# EAGLE design thinMan (EAGLE 6.6.0)

## Sheet 1 of 4
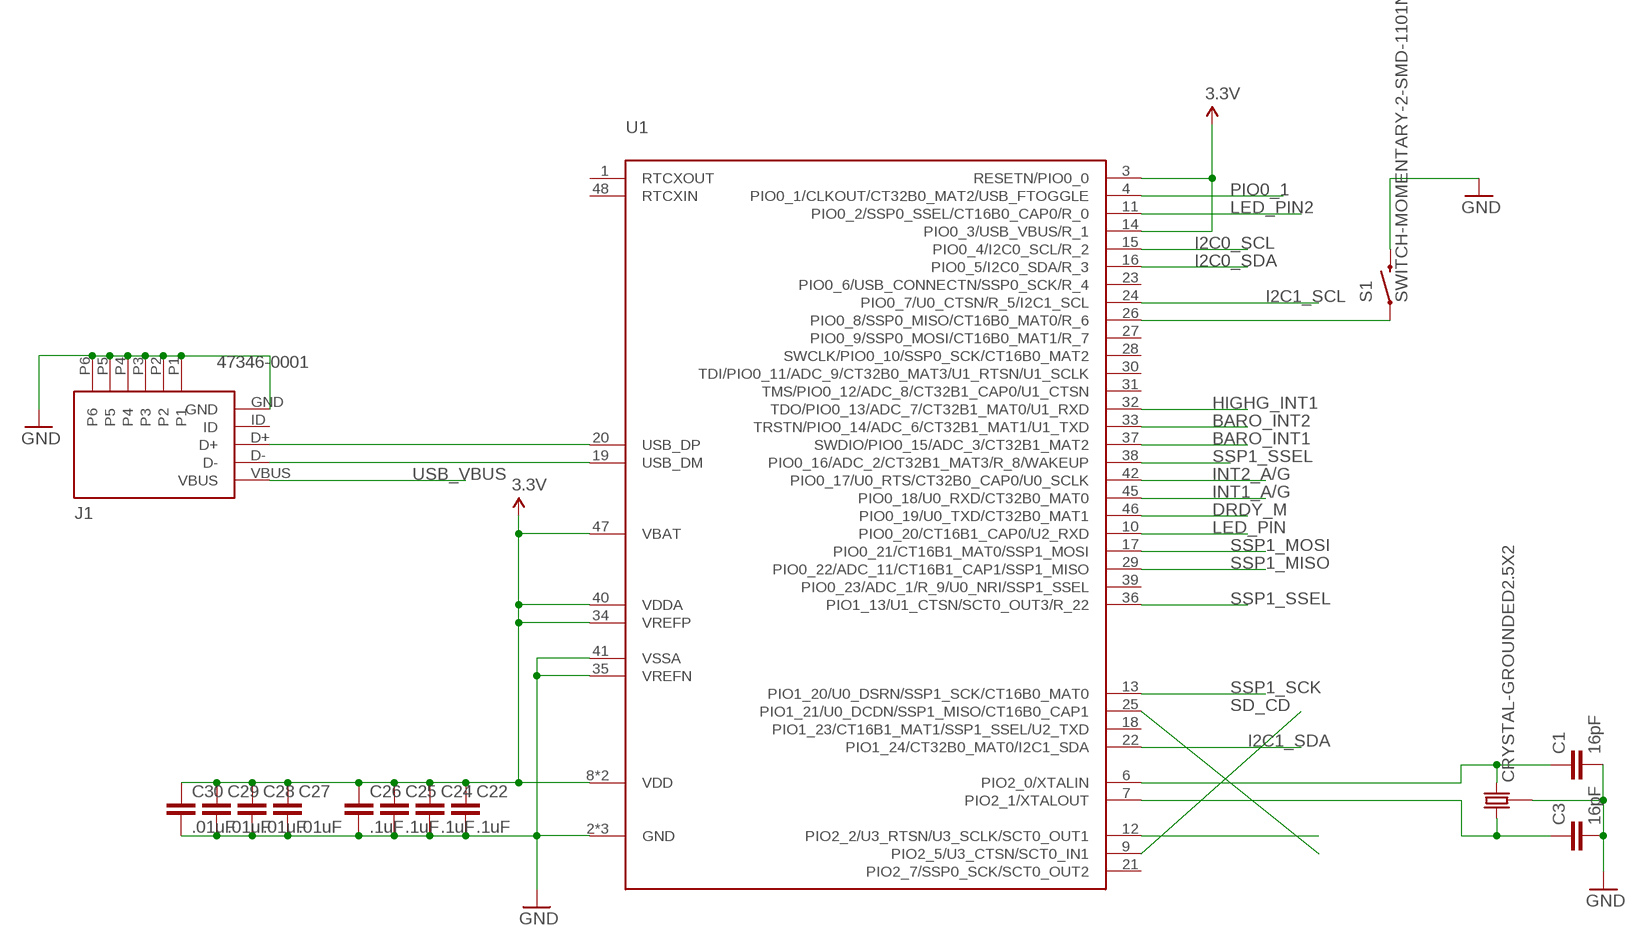
[diagram p0: schematic, sheet 1]

### Parts
C1  16pF  C0402  [C0402]
C3  16pF  C0402  [C0402]
C22  .1uF  C0402  [C0402]
C24  .1uF  C0402  [C0402]
C25  .1uF  C0402  [C0402]
C26  .1uF  C0402  [C0402]
C27  .01uF  C0402  [C0402]
C28  .01uF  C0402  [C0402]
C29  .01uF  C0402  [C0402]
C30  .01uF  C0402  [C0402]
J1  47346-0001  MICRO-USB  [MICRO_USB]
S1  SWITCH-MOMENTARY-2-SMD-1101NE  [TACTILE-SWITCH-1101NE]
U1  LPC11U68JBD48  [LQFP48]
U$5  CRYSTAL-GROUNDED2.5X2  [CRYSTAL-SMD-2.5X2]

### Nets
3.3V: C22.1 C24.1 C25.1 C26.1 C27.1 C28.1 C29.1 C30.1 U1.3(RESETN/PIO0_0) U1.8(VDD) U1.14(PIO0_3/USB_VBUS/R_1) U1.34(VREFP) U1.40(VDDA) U1.44(VDD) U1.47(VBAT) ; also sheet 2,3,4
BARO_INT1: U1.37(SWDIO/PIO0_15/ADC_3/CT32B1_MAT2) ; also sheet 2
BARO_INT2: U1.33(TRSTN/PIO0_14/ADC_6/CT32B1_MAT1/U1_TXD)
DRDY_M: U1.46(PIO0_19/U0_TXD/CT32B0_MAT1) ; also sheet 2
GND: C1.2 C3.2 C22.2 C24.2 C25.2 C26.2 C27.2 C28.2 C29.2 C30.2 J1.GND J1.P1 J1.P2 J1.P3 J1.P4 J1.P5 J1.P6 S1.2 U1.2(GND) U1.5(GND) U1.35(VREFN) U1.41(VSSA) U1.43(GND) U$5.GND1 U$5.GND2 ; also sheet 2,3,4
HIGHG_INT1: U1.32(TDO/PIO0_13/ADC_7/CT32B1_MAT0/U1_RXD)
HIGHG_INT2: U1.36(PIO1_13/U1_CTSN/SCT0_OUT3/R_22)
I2C0_SCL: U1.15(PIO0_4/I2C0_SCL/R_2) ; also sheet 2
I2C0_SDA: U1.16(PIO0_5/I2C0_SDA/R_3) ; also sheet 2
I2C1_SCL: U1.24(PIO0_7/U0_CTSN/R_5/I2C1_SCL) ; also sheet 2,3
I2C1_SDA: U1.22(PIO1_24/CT32B0_MAT0/I2C1_SDA) ; also sheet 2,3
INT1_A/G: U1.45(PIO0_18/U0_RXD/CT32B0_MAT0) ; also sheet 2
INT2_A/G: U1.42(PIO0_17/U0_RTS/CT32B0_CAP0/U0_SCLK)
LED_PIN: U1.10(PIO0_20/CT16B1_CAP0/U2_RXD) ; also sheet 3
LED_PIN2: U1.11(PIO0_2/SSP0_SSEL/CT16B0_CAP0/R_0) ; also sheet 3
N$2: C3.1 U1.7(PIO2_1/XTALOUT) U$5.P1
N$3: C1.1 U1.6(PIO2_0/XTALIN) U$5.P2
N$15: J1.D+ U1.20(USB_DP)
N$17: J1.D- U1.19(USB_DM)
N$18: U1.25(PIO1_21/U0_DCDN/SSP1_MISO/CT16B0_CAP1)
N$19: S1.1 U1.26(PIO0_8/SSP0_MISO/CT16B0_MAT0/R_6)
N$22: U1.12(PIO2_2/U3_RTSN/U3_SCLK/SCT0_OUT1)
PIO0_1: U1.4(PIO0_1/CLKOUT/CT32B0_MAT2/USB_FTOGGLE) ; also sheet 4
SD_CD: U1.9(PIO2_5/U3_CTSN/SCT0_IN1) ; also sheet 3
SSP1_MISO: U1.29(PIO0_22/ADC_11/CT16B1_CAP1/SSP1_MISO) ; also sheet 3
SSP1_MOSI: U1.17(PIO0_21/CT16B1_MAT0/SSP1_MOSI) ; also sheet 3
SSP1_SCK: U1.13(PIO1_20/U0_DSRN/SSP1_SCK/CT16B0_MAT0) ; also sheet 3
SSP1_SSEL: U1.38(PIO0_16/ADC_2/CT32B1_MAT3/R_8/WAKEUP) ; also sheet 3
USB_VBUS: J1.VBUS ; also sheet 4
Unconnected: J1.ID U1.1(RTCXOUT) U1.18(PIO1_23/CT16B1_MAT1/SSP1_SSEL/U2_TXD) U1.21(PIO2_7/SSP0_SCK/SCT0_OUT2) U1.23(PIO0_6/USB_CONNECTN/SSP0_SCK/R_4) U1.27(PIO0_9/SSP0_MOSI/CT16B0_MAT1/R_7) U1.28(SWCLK/PIO0_10/SSP0_SCK/CT16B0_MAT2) U1.30(TDI/PIO0_11/ADC_9/CT32B0_MAT3/U1_RTSN/U1_SCLK) U1.31(TMS/PIO0_12/ADC_8/CT32B1_CAP0/U1_CTSN) U1.39(PIO0_23/ADC_1/R_9/U0_NRI/SSP1_SSEL) U1.48(RTCXIN)

## Sheet 2 of 4
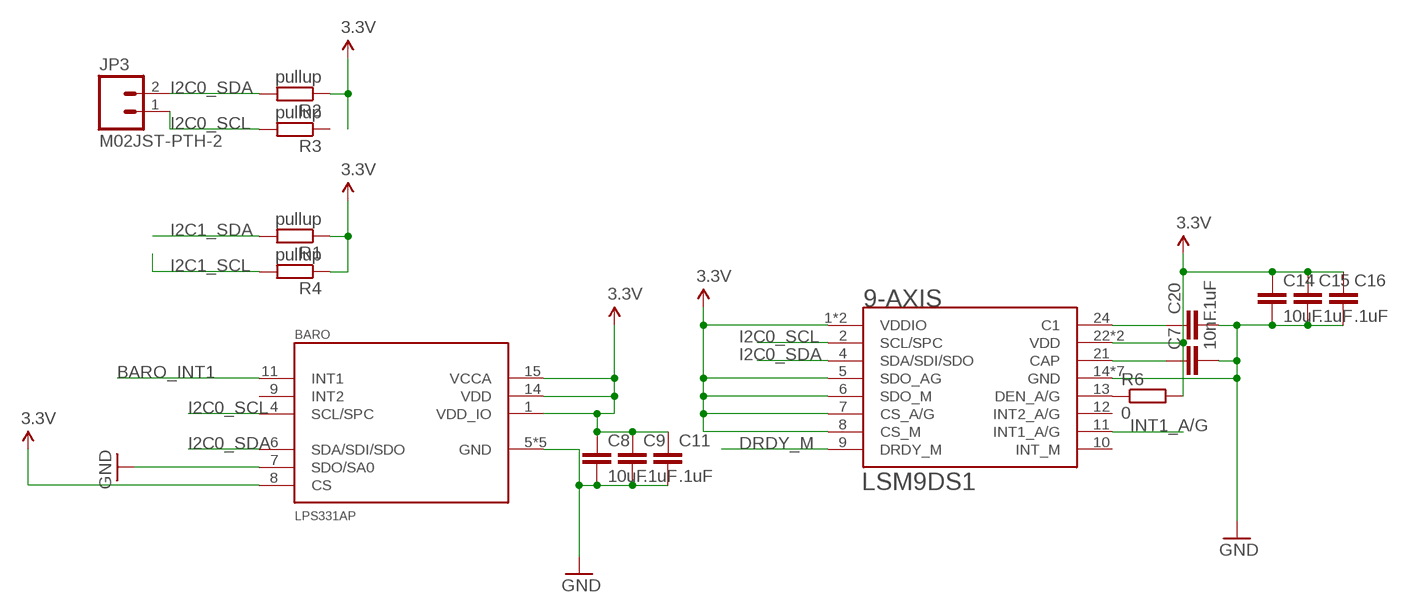
[diagram p1: schematic, sheet 2]

### Parts
9-AXIS  LSM9DS1  [LGA-24L-3.5X3X1]
BARO  LPS331AP  [LGA-16-3X3X1]
C7  10nF  C0402  [C0402]
C8  10uF  C0402  [C0402]
C9  .1uF  C0402  [C0402]
C11  .1uF  C0402  [C0402]
C14  10uF  C0402  [C0402]
C15  .1uF  C0402  [C0402]
C16  .1uF  C0402  [C0402]
C20  .1uF  C0402  [C0402]
JP3  M02JST-PTH-2  [JST-2-PTH]
R1  pullup  R0805  [R0805]
R2  pullup  R0402  [R0402]
R3  pullup  R0402  [R0402]
R4  pullup  R0805  [R0805]
R6  0  R0402  [R0402]

### Nets
3.3V: 9-AXIS.1(VDDIO) 9-AXIS.3(VDDIO) 9-AXIS.5(SDO_AG) 9-AXIS.6(SDO_M) 9-AXIS.7(CS_A/G) 9-AXIS.8(CS_M) 9-AXIS.22(VDD) 9-AXIS.23(VDD) BARO.1(VDD_IO) BARO.8(CS) BARO.14(VDD) BARO.15(VCCA) C8.1 C9.1 C11.1 C14.1 C15.1 C16.1 R1.1 R2.1 R4.1 R6.2 ; also sheet 1,3,4
BARO_INT1: BARO.11(INT1) ; also sheet 1
DRDY_M: 9-AXIS.9(DRDY_M) ; also sheet 1
GND: 9-AXIS.14(GND) 9-AXIS.15(GND) 9-AXIS.16(GND) 9-AXIS.17(GND) 9-AXIS.18(GND) 9-AXIS.19(GND) 9-AXIS.20(GND) BARO.5(GND) BARO.7(SDO/SA0) BARO.10(GND) BARO.12(GND) BARO.13(GND) BARO.16(GND) C7.2 C8.2 C9.2 C11.2 C14.2 C15.2 C16.2 C20.2 ; also sheet 1,3,4
I2C0_SCL: 9-AXIS.2(SCL/SPC) BARO.4(SCL/SPC) JP3.1 R3.2 ; also sheet 1
I2C0_SDA: 9-AXIS.4(SDA/SDI/SDO) BARO.6(SDA/SDI/SDO) JP3.2 R2.2 ; also sheet 1
I2C1_SCL: R4.2 ; also sheet 1,3
I2C1_SDA: R1.2 ; also sheet 1,3
INT1_A/G: 9-AXIS.11(INT1_A/G) ; also sheet 1
N$1: 9-AXIS.13(DEN_A/G) R6.1
N$11: 9-AXIS.21(CAP) C7.1
N$14: 9-AXIS.24(C1) C20.1
Unconnected: 9-AXIS.10(INT_M) 9-AXIS.12(INT2_A/G) BARO.9(INT2) R3.1

## Sheet 3 of 4
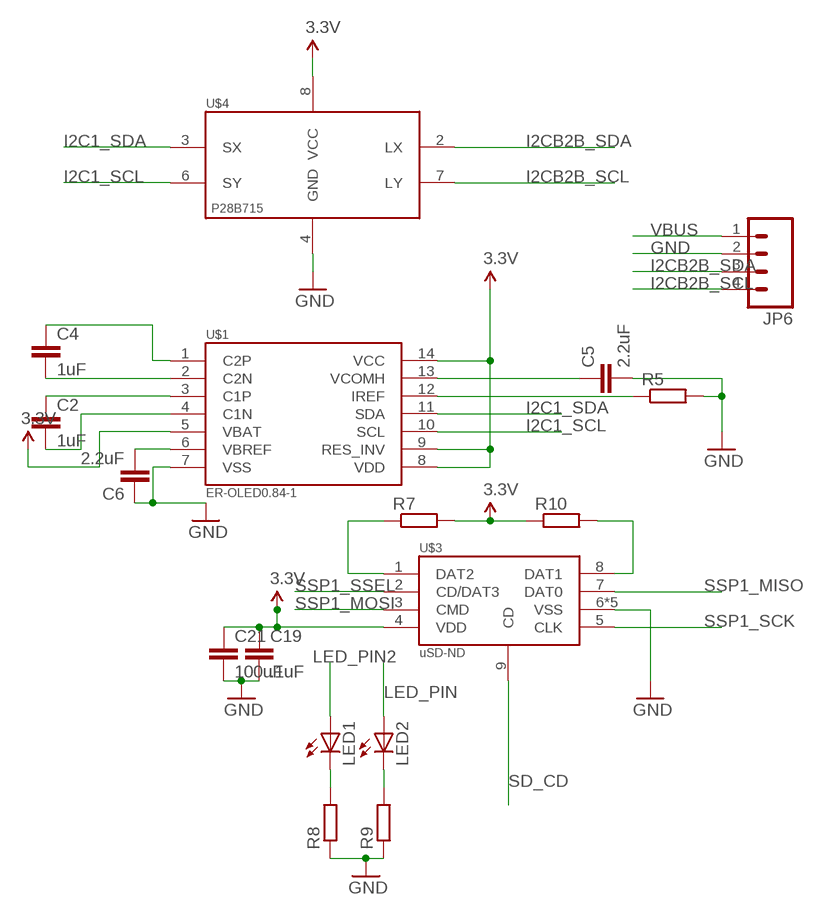
[diagram p2: schematic, sheet 3]

### Parts
C2  1uF  C0402  [C0402]
C4  1uF  C0402  [C0402]
C5  2.2uF  C0402  [C0402]
C6  2.2uF  C0402  [C0402]
C19  .1uF  C0402  [C0402]
C21  100uF  CC1206  [C1206]
JP6  M04JST  [1X04-1.5MM_JST]
LED1  LEDCHIPLED_0603  [CHIPLED_0603]
LED2  LEDCHIPLED_0603  [CHIPLED_0603]
R5  R0402  [R0402]
R7  R0402  [R0402]
R8  R0402  [R0402]
R9  R0402  [R0402]
R10  R0402  [R0402]
U$1  ER-OLED0.84-1  [MOLEX_52892-1433]
U$3  MICROSD-CD  [MOLEX_SD-47352-101]
U$4  P82B715  [SO8]

### Nets
3.3V: C19.1 C21.1 R7.2 R10.1 U$1.5(VBAT) U$1.8(VDD) U$1.9(RES_INV) U$1.14(VCC) U$3.4(VDD) U$4.8(VCC) ; also sheet 1,2,4
GND: C5.2 C6.1 C19.2 C21.2 JP6.2 R5.2 R8.1 R9.1 U$1.7(VSS) U$3.6(VSS) U$3.G1(VSS) U$3.G2(VSS) U$3.G3(VSS) U$3.G4(VSS) U$4.4(GND) ; also sheet 1,2,4
I2C1_SCL: U$1.10(SCL) U$4.6(SY) ; also sheet 1,2
I2C1_SDA: U$1.11(SDA) U$4.3(SX) ; also sheet 1,2
I2CB2B_SCL: JP6.4 U$4.7(LY)
I2CB2B_SDA: JP6.3 U$4.2(LX)
LED_PIN: LED2.A ; also sheet 1
LED_PIN2: LED1.A ; also sheet 1
N$4: LED1.C R8.2
N$5: LED2.C R9.2
N$6: C4.1 U$1.1(C2P)
N$7: C4.2 U$1.2(C2N)
N$8: C2.1 U$1.3(C1P)
N$9: C2.2 U$1.4(C1N)
N$10: C5.1 U$1.13(VCOMH)
N$12: R5.1 U$1.12(IREF)
N$13: C6.2 U$1.6(VBREF)
N$16: R7.1 U$3.1(DAT2)
N$21: R10.2 U$3.8(DAT1)
SD_CD: U$3.9(CD) ; also sheet 1
SSP1_MISO: U$3.7(DAT0) ; also sheet 1
SSP1_MOSI: U$3.3(CMD) ; also sheet 1
SSP1_SCK: U$3.5(CLK) ; also sheet 1
SSP1_SSEL: U$3.2(CD/DAT3) ; also sheet 1
VBUS: JP6.1 ; also sheet 4

## Sheet 4 of 4: Power
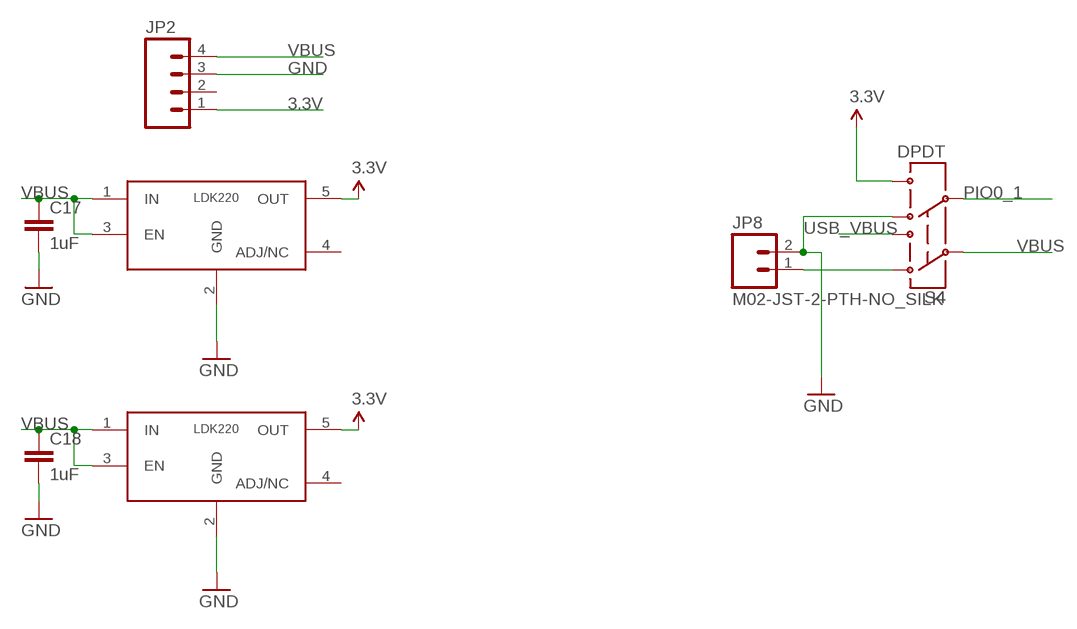
[diagram p3: schematic, sheet 4]

### Parts
C17  1uF  C0402  [C0402]
C18  1uF  C0402  [C0402]
JP2  M04JST  [1X04-1.5MM_JST]
JP8  M02-JST-2-PTH-NO_SILK  [JST-2-PTH-NS]
S4  DPDT  SWITCH-DPDTAYZ0202  [AYZ0202]
U$2  LDK220M33R  [SOT23-5]
U$6  LDK220M33R  [SOT23-5]

### Nets
3.3V: JP2.1 S4.6 U$2.5(OUT) U$6.5(OUT) ; also sheet 1,2,3
GND: C17.2 C18.2 JP2.3 JP8.2 S4.4 U$2.2(GND) U$6.2(GND) ; also sheet 1,2,3
N$20: JP8.1 S4.1
PIO0_1: S4.5 ; also sheet 1
USB_VBUS: S4.3 ; also sheet 1
VBUS: C17.1 C18.1 JP2.4 S4.2 U$2.1(IN) U$2.3(EN) U$6.1(IN) U$6.3(EN) ; also sheet 3
Unconnected: JP2.2 U$2.4(ADJ/NC) U$6.4(ADJ/NC)

## Library data of the parts
9-AXIS = Sensors:LSM9DS1; OC_NEWARK: unknown
BARO = Sensors:LPS331AP; MPN: LPS331APTR; OC_NEWARK: 52X6707
C1 C3 = ELL-i-Passives:C: Surface Mount Capasitors — in standard sizes A capacitor used to store energy electrostatically in an electric field. If you need a high-value capacitor, consider using a polarised capacitor to save space. Wikipedia article on capacitors <https://en.wikipedia.org/wiki/Capacitor>; OC_NEWARK: unknown
C2 C4 = ELL-i-Passives:C: Surface Mount Capasitors — in standard sizes A capacitor used to store energy electrostatically in an electric field. If you need a high-value capacitor, consider using a polarised capacitor to save space. Wikipedia article on capacitors <https://en.wikipedia.org/wiki/Capacitor>; MPN: MC0402X105M6R3CT; OC_NEWARK: 06R4879
C5 C6 = ELL-i-Passives:C: Surface Mount Capasitors — in standard sizes A capacitor used to store energy electrostatically in an electric field. If you need a high-value capacitor, consider using a polarised capacitor to save space. Wikipedia article on capacitors <https://en.wikipedia.org/wiki/Capacitor>; MPN: C1005X6S0G225M050BC; OC_NEWARK: 91R0047
C7 C20 = ELL-i-Passives:C: Surface Mount Capasitors — in standard sizes A capacitor used to store energy electrostatically in an electric field. If you need a high-value capacitor, consider using a polarised capacitor to save space. Wikipedia article on capacitors <https://en.wikipedia.org/wiki/Capacitor>; MPN: S103M47Z5UN63L0R; OC_NEWARK: 83K9283
C8 C9 C11 C14-C19 C21 C22 C24-C30 = ELL-i-Passives:C: Surface Mount Capasitors — in standard sizes A capacitor used to store energy electrostatically in an electric field. If you need a high-value capacitor, consider using a polarised capacitor to save space. Wikipedia article on capacitors <https://en.wikipedia.org/wiki/Capacitor>
J1 = ELL-i-Connectors:MICRO-USB: Micro USB from Molex CONN RCPT 5POS MICRO USB R/A Datasheet <http://www.molex.com/pdm_docs/sd/473460001_sd.pdf>; PARTNO: AS-ITM-00021
JP2 = SparkFun-Connectors:M04: Header 4 Standard 4-pin 0.1" header. Use with straight break away headers (SKU : PRT-00116), right angle break away headers (PRT-00553), swiss pins (PRT-00743), machine pins (PRT-00117), and female headers (PRT-00115). Molex polarized connector foot print use with SKU : PRT-08231 with associated crimp pins and housings. 1MM SMD Version SKU: PRT-10208
JP3 = SparkFun-Connectors:M02: Standard 2-pin 0.1" header. Use with - straight break away headers ( PRT-00116) - right angle break away headers (PRT-00553) - swiss pins (PRT-00743) - machine pins (PRT-00117) - female headers (PRT-00115) Molex polarized connector foot print use with: PRT-08233 with associated crimp pins and housings. 2.54_SCREWTERM for use with PRT-10571. 3.5mm Screw Terminal footprints for PRT-08084 5mm Screw Terminal footprints for use with PRT-08432; OC_NEWARK: unknown; SKU: PRT-09914
JP6 = SparkFun-Connectors:M04: Header 4 Standard 4-pin 0.1" header. Use with straight break away headers (SKU : PRT-00116), right angle break away headers (PRT-00553), swiss pins (PRT-00743), machine pins (PRT-00117), and female headers (PRT-00115). Molex polarized connector foot print use with SKU : PRT-08231 with associated crimp pins and housings. 1MM SMD Version SKU: PRT-10208; OC_NEWARK: unknown
JP8 = SparkFun-Connectors:M02: Standard 2-pin 0.1" header. Use with - straight break away headers ( PRT-00116) - right angle break away headers (PRT-00553) - swiss pins (PRT-00743) - machine pins (PRT-00117) - female headers (PRT-00115) Molex polarized connector foot print use with: PRT-08233 with associated crimp pins and housings. 2.54_SCREWTERM for use with PRT-10571. 3.5mm Screw Terminal footprints for PRT-08084 5mm Screw Terminal footprints for use with PRT-08432; OC_NEWARK: unknown
LED1 LED2 = adafruit:LED: LED OSRAM: - CHIPLED LG R971, LG N971, LY N971, LG Q971, LY Q971, LO R971, LY R971 LH N974, LH R974 LS Q976, LO Q976, LY Q976 LO Q996 - Hyper CHIPLED LW Q18S LB Q993, LB Q99A, LB R99A - SideLED LS A670, LO A670, LY A670, LG A670, LP A670 LB A673, LV A673, LT A673, LW A673 LH A674 LY A675 LS A676, LA A676, LO A676, LY A676, LW A676 LS A679, LY A679, LG A679 - Hyper Micro SIDELED® LS Y876, LA Y876, LO Y876, LY Y876 LT Y87S - SmartLED LW L88C, LW L88S LB L89C, LB L89S, LG L890 LS L89K, LO L89K, LY L89K LS L896, LA L896, LO L896, LY L896 - TOPLED LS T670, LO T670, LY T670, LG T670, LP T670 LSG T670, LSP T670, LSY T670, LOP T670, LYG T670 LG T671, LOG T671, LSG T671 LB T673, LV T673, LT T673, LW T673 LH T674 LS T676, LA T676, LO T676, LY T676, LB T676, LH T676, LSB T676, LW T676 LB T67C, LV T67C, LT T67C, LS T67K, LO T67K, LY T67K, LW E67C LS E67B, LA E67B, LO E67B, LY E67B, LB E67C, LV E67C, LT E67C LW T67C LS T679, LY T679, LG T679 LS T770, LO T770, LY T770, LG T770, LP T770 LB T773, LV T773, LT T773, LW T773 LH T774 LS E675, LA E675, LY E675, LS T675 LS T776, LA T776, LO T776, LY T776, LB T776 LHGB T686 LT T68C, LB T68C - Hyper Mini TOPLED® LB M676 - Mini TOPLED Santana® LG M470 LS M47K, LO M47K, LY M47K Source: http://www.osram.convergy.de/; OC_NEWARK: unknown
R1-R5 R8 R9 = ELL-i-Passives:R: Surface Mount Resistor — in standard sizes; OC_NEWARK: unknown
R6 R7 R10 = ELL-i-Passives:R: Surface Mount Resistor — in standard sizes
S1 = SparkFun-Electromechanical:SWITCH-MOMENTARY-2: Various NO switches- pushbuttons, reed, etc; OC_NEWARK: unknown
S4 = SparkFun-Electromechanical:SWITCH-DPDT: DPDT Version of the COM-00597; OC_NEWARK: unknown; PROD_ID: SWCH-08179
U1 = LPC11U68:LPC11U68JBD48; OC_NEWARK: unknown
U$1 = Sensors:ER-OLED0.84-1; OC_NEWARK: unknown
U$2 U$6 = Sensors:LDK220M33R; OC_NEWARK: unknown
U$3 = Sensors:MICROSD-CD; OC_NEWARK: unknown
U$4 = Sensors:P82B715; OC_NEWARK: unknown
U$5 = SparkFun-FreqCtrl:CRYSTAL-GROUNDED; OC_NEWARK: unknown

## Board
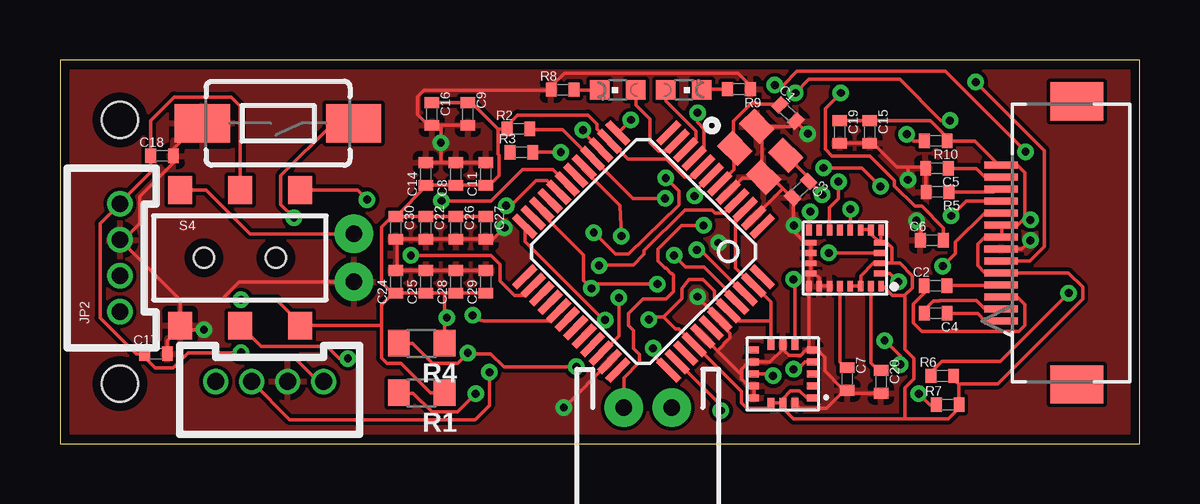
[diagram p4: board, top side]
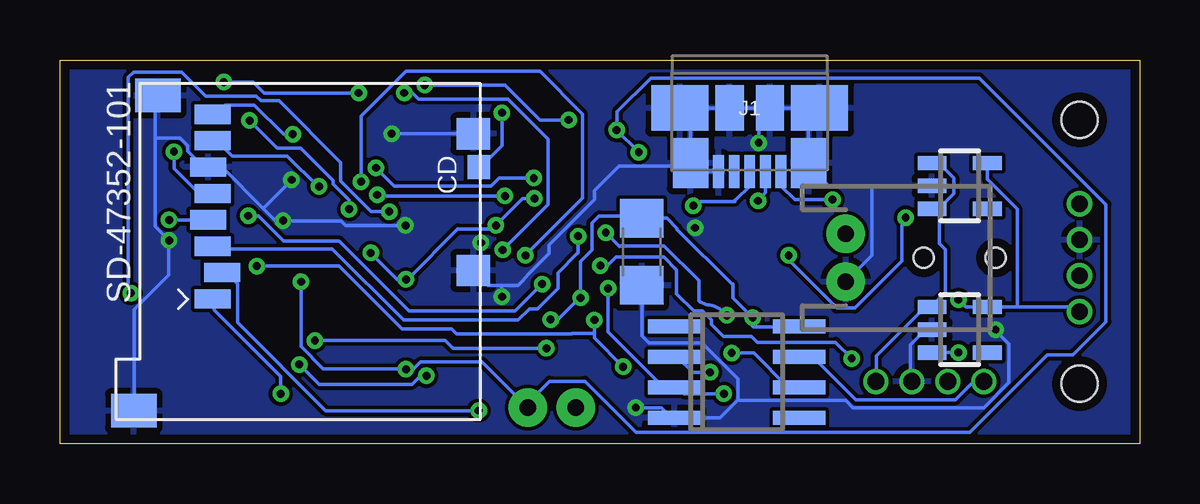
[diagram p5: board, bottom side, seen from below]

Size 45 x 16 mm. Coordinates in mm from the lower left corner, seen from the top.
Outline: 0,0 45,0 45,16 0,16 0,0
Copper layers (1*16): Top 0.0356mm / dielectric 1.5011mm / Bottom 0.0356mm
Design rules "LaenPCBOrder *": minimum track width 6mil, minimum drill 13mil, track to track 6mil, track to pad 6mil, pad to pad 6mil, via to via 6mil, smd to smd 6mil, copper to edge 15mil, drill to drill 6mil, minimum pad ring 7mil, minimum via ring 7mil, stop-mask expansion 3mil, vias tented up to drill 0mil, thermal gap 10mil
Holes 1.5 mm at 2.5,2.5 2.5,13.5

### Footprints (pad centres in the part's own frame; a part is rotated, then mirrored left to right if it is on the bottom)
LGA-24L-3.5X3X1 = smd 0.24 x 0.45: 1 0.245,2.675; 6 0.245,0.325; 7 0.675,0.325; 8 1.105,0.325; 9 1.535,0.325; 10 1.965,0.325; 11 2.395,0.325; 12 2.825,0.325; 13 3.255,0.325; 18 3.255,2.675; 19 2.825,2.675; 20 2.395,2.675; 21 1.965,2.675; 22 1.535,2.675; 23 1.105,2.675; 24 0.675,2.675 | smd 0.45 x 0.24: 2 0.325,2.145; 3 0.325,1.715; 4 0.325,1.285; 5 0.325,0.855; 14 3.175,0.855; 15 3.175,1.285; 16 3.175,1.715; 17 3.175,2.145
LGA-16-3X3X1 = smd 0.45 x 0.3: 1 0.275,2.5; 2 0.275,2; 3 0.275,1.5; 4 0.275,1; 5 0.275,0.5; 9 2.725,0.5; 10 2.725,1; 11 2.725,1.5; 12 2.725,2; 13 2.725,2.5 | smd 0.3 x 0.45: 6 1,0.275; 7 1.5,0.275; 8 2,0.275; 14 2,2.725; 15 1.5,2.725; 16 1,2.725
C0402 = smd 0.45 x 0.6: 1 -0.475,0; 2 0.475,0
C1206 = smd 1.6 x 1.8: 1 -1.4,0; 2 1.4,0
MICRO_USB = smd 1.38 x 0.45: D+ 2.66,0; D- 2.66,0.65; GND 2.66,-1.3; ID 2.66,-0.65; VBUS 2.66,1.3 | smd 2.1 x 1.475: P1 2.3,-2.462; P2 2.3,2.462 | smd 1.9 x 2.375: P3 0,2.913; P4 0,-2.913 | smd 1.9 x 1.175: P5 0,0.838; P6 0,-0.838
1X04-1.5MM_JST = drill 0.7: 1 0,0; 2 1.5,0; 3 3,0; 4 4.5,0
JST-2-PTH = drill 0.7 pad 1.6: 1 -1,0; 2 1,0
JST-2-PTH-NS = drill 0.7 pad 1.6: 1 -1,0; 2 1,0
CHIPLED_0603 = smd 0.8 x 0.8: A 0,-0.75; C 0,0.75
R0805 = smd 0.9 x 1.1: 1 -0.95,0; 2 0.95,0
R0402 = smd 0.45 x 0.6: 1 -0.475,0; 2 0.475,0
TACTILE-SWITCH-1101NE = smd 2.3 x 1.6: 1 -3.15,0; 2 3.15,0
AYZ0202 = smd 1 x 1.15: 1 -2.5,2.825; 2 0,2.825; 3 2.5,2.825; 4 -2.5,-2.825; 5 0,-2.825; 6 2.5,-2.825 | hole 0.85: 1.5,0; -1.5,0
LQFP48 = smd 0.3 x 1.2: 1 -2.75,-4.25; 2 -2.25,-4.25; 3 -1.75,-4.25; 4 -1.25,-4.25; 5 -0.75,-4.25; 6 -0.25,-4.25; 7 0.25,-4.25; 8 0.75,-4.25; 9 1.25,-4.25; 10 1.75,-4.25; 11 2.25,-4.25; 12 2.75,-4.25; 25 2.75,4.25; 26 2.25,4.25; 27 1.75,4.25; 28 1.25,4.25; 29 0.75,4.25; 30 0.25,4.25; 31 -0.25,4.25; 32 -0.75,4.25; 33 -1.25,4.25; 34 -1.75,4.25; 35 -2.25,4.25; 36 -2.75,4.25 | smd 1.2 x 0.3: 13 4.25,-2.75; 14 4.25,-2.25; 15 4.25,-1.75; 16 4.25,-1.25; 17 4.25,-0.75; 18 4.25,-0.25; 19 4.25,0.25; 20 4.25,0.75; 21 4.25,1.25; 22 4.25,1.75; 23 4.25,2.25; 24 4.25,2.75; 37 -4.25,2.75; 38 -4.25,2.25; 39 -4.25,1.75; 40 -4.25,1.25; 41 -4.25,0.75; 42 -4.25,0.25; 43 -4.25,-0.25; 44 -4.25,-0.75; 45 -4.25,-1.25; 46 -4.25,-1.75; 47 -4.25,-2.25; 48 -4.25,-2.75
MOLEX_52892-1433 = smd 0.3 x 1.4: 1 3.25,2.896; 2 2.75,2.896; 3 2.25,2.896; 4 1.75,2.896; 5 1.25,2.896; 6 0.75,2.896; 7 0.25,2.896; 8 -0.25,2.896; 9 -0.75,2.896; 10 -1.25,2.896; 11 -1.75,2.896; 12 -2.25,2.896; 13 -2.75,2.896; 14 -3.25,2.896 | smd 1.6 x 2.2: LFIT -5.9,6.046; RFIT 5.9,6.046
SOT23-5 = smd 0.6 x 1.2: 1 -0.95,-1.15; 2 0,-1.15; 3 0.95,-1.15; 4 0.95,1.15; 5 -0.95,1.15
MOLEX_SD-47352-101 = smd 0.8 x 1.5: 1 9.19,3.24; 2 8.09,3.64; 3 6.99,3.24; 4 5.89,3.04; 5 4.79,3.24; 6 3.69,3.04; 7 2.59,3.24; 8 1.49,3.24 | smd 1 x 0.95: 9 3.69,14.325 | smd 1.4 x 1.9: G1 13.85,-0.05; G4 0.7,0.95 | smd 1.3 x 1.4: G2 8,14.1; G3 2.3,14.1
SO8 = smd 0.6 x 2.2: 1 -1.905,-2.6; 2 -0.635,-2.6; 3 0.635,-2.6; 4 1.905,-2.6; 5 1.905,2.6; 6 0.635,2.6; 7 -0.635,2.6; 8 -1.905,2.6
CRYSTAL-SMD-2.5X2 = smd 1.2 x 0.9: GND1 0.6,1.8; GND2 2.3,0.5; P1 2.3,1.8; P2 0.6,0.5

### Placement (x,y rotation side)
9-AXIS  34.48,9.23 180 top
BARO  31.63,4.4 180 top
C1  30.34,13.79 315 top
C2  36.5,6.58 0 top
C3  30.87,10.6 225 top
C4  36.5,5.43 180 top
C5  36.55,11.48 180 top
C6  36.34,8.48 0 top
C7  32.82,2.69 270 top
C8  16.5,11.25 90 top
C9  17,13.75 270 top
C11  17.75,11.25 90 top
C14  15.25,11.25 90 top
C15  33.75,13 270 top
C16  15.5,13.75 270 top
C17  4,3.75 0 top
C18  4.25,12 0 top
C19  32.5,13 270 top
C20  34.23,2.58 270 top
C21  20.75,8 270 bottom
C22  15.25,9 270 top
C24  14,6.75 90 top
C25  15.25,6.75 90 top
C26  16.5,9 270 top
C27  17.75,9 270 top
C28  16.5,6.75 90 top
C29  17.75,6.75 90 top
C30  14,9 270 top
J1  16.25,14 270 bottom
JP2  2.5,5.5 90 top
JP3  24.5,1.5 180 top
JP6  10.99,2.59 180 top
JP8  12.25,7.75 270 bottom
LED1  23.25,14.75 90 top
LED2  26,14.75 270 top
R1  15.08,2.12 180 top
R2  19.11,13.12 0 top
R3  19.23,12.15 0 top
R4  15.08,4.18 180 top
R5  36.58,10.49 180 top
R6  36.77,2.83 0 top
R7  37,1.62 0 top
R8  20.95,14.76 0 top
R9  28.3,14.78 180 top
R10  36.5,12.62 180 top
S1  9.09,13.36 180 top
S4  7.5,7.75 0 top
U1  24.32,8.01 135 top
U$1  36.34,8.37 270 top
U$2  7.5,10.75 270 bottom
U$3  41.87,15.22 270 bottom
U$4  16.79,2.98 270 bottom
U$5  27.35,12.38 315 top
U$6  7.5,4.75 270 bottom

### Tracks (layer width: path | path; a pad name or v marks a point on that pad's centre or on a via)
3.3V  (via drill 0.33)
  Top 0.152: C19.1 C15.1 36.27,13.47 36.98,12.78 R10.1 38.12,12.62 39.12,11.62 U$1.14 39.3,11.62 39.9,11.62 40.23,11.3 40.23,9.4 v40.45,9.32 40.12,9.32 39.92,9.12 39.33,9.12 U$1.9 39.25,9.1 39.25,8.7 U$1.8 38.55,8.62 38.25,8.32 38.25,7.42 38.55,7.12 U$1.5 39.3,7.12 42.02,7.12 42.62,6.53 42.62,6.03 39.1,2.5 37.55,2.5 37.48,2.48 | 26.43,4.12 U1.40 | 29.62,5.12 29.62,5.9 U1.47 28.85,6.62 28.15,7.33 28.15,9.38 U1.3 | 29.62,5.12 29.62,4.15 BARO.8 | 29.62,5.12 28.3,5.12 27.93,5.5 U1.44 27.85,5.53 27.27,6.1 27.27,6.38 26.8,6.85 26.23,6.85 25.93,6.47 25.93,6.05 25.15,5.28 | 9-AXIS.5 34.15,8.4 33.8,8.75 9-AXIS.7 33.73,8.93 33.38,8.93 9-AXIS.8 | 9-AXIS.6 34.23,8.43 9-AXIS.5 | 9-AXIS.22 32.95,6.58 33.35,6.58 9-AXIS.23 33.38,6.65 33.38,7 33.9,7.53 9-AXIS.3 34.23,7.53 34.67,7.53 | 35.2,6.17 34.7,6.17 34.33,6.55 34.25,6.55 9-AXIS.1 | 35.2,6.17 35.52,6.5 35.52,7 35,7.53 34.67,7.53 | 34.67,7.53 34.67,8.18 34.48,8.38 34.33,8.38 34.3,8.4 9-AXIS.5 | 37.48,2.48 R7.2 37.45,1.55 37.45,1.45 37.02,1.02 35.23,1.02 | 37.48,2.48 37.25,2.7 R6.2 | BARO.15 30.12,1.7 29.65,1.7 BARO.14 29.65,1.62 29.5,1.48 28.62,1.48 28.4,1.7 28.4,2.17 26.5,4.08 U1.40 | BARO.1 31.12,1.9 30.82,2.2 30.45,2.2 30.12,1.88 30.12,1.77 BARO.15 | 35.23,1.02 30.57,1.02 30.12,1.48 30.12,1.62 BARO.15 | 35.23,1.02 35.23,2.33 35.6,2.7 35.6,3.55 35.23,3.92 35.23,6.1 35.2,6.17 | v23.3,6.08 23.3,4.5 22.57,3.77 U1.34 | C24.1 C25.1 16.02,6.28 | 16.02,6.28 C28.1 C29.1 | 13.4,4.92 13.4,5.78 13.93,6.3 C24.1 | 13.4,4.92 13.4,3.58 13.62,3.35 14.22,3.35 15.45,2.12 R1.1 | 16.02,6.28 16.02,5.25 | 16.02,5.25 16.02,4.2 R4.1 | 13.4,4.92 S4.6 10.03,5 9.03,6 v7.55,6
  Top 0.152: U1.8 26.77,11.53 26.38,11.12 26.02,11.12 25.27,11.88 23.68,11.88 22.93,12.62 U1.14 22.85,12.65 22.38,13.12 22.38,13.32 22,13.7 19.07,13.7 18.62,13.25 18.62,13.2 R2.1 18.25,13.12 | C16.1 C9.1 17.15,14.22 18.25,13.12 | 15.3,10.78 C8.1 C11.1 17.9,10.78 18.3,11.18 18.3,12.03 18.25,12.07 18.25,13.12 | 15.3,10.78 C14.1 | C30.1 C22.1 C26.1 C27.1 | C24.1 13.78,6.25 13.78,6.35 13.4,6.72 13.4,9.03 13.85,9.47 C30.1 | v16.12,5.25 16.02,5.25 | 15.3,10.78 C30.1 | 25.15,5.28 24.65,5.28 v24.55,5.17 | U1.40 26.44,4.13 25.8,4.78 25.65,4.78 25.15,5.28
  Bottom 0.152: v40.45,9.32 38.85,9.32 U$3.4 | C21.1 21.48,9.4 | U$4.8 16.1,4.88 16.3,5.08 v16.12,5.25 16.95,6.08 16.95,6.65 17,6.65 19.27,8.93 19.27,8.97 19.7,9.4 C21.1 | 5.1,5.7 2.7,5.7 JP2.1 | 5.1,5.7 U$6.5 7.25,5.7 v7.55,6 | U$2.5 6.35,11.03 5.1,9.78 5.1,5.7 | C21.1 20.85,9.5 22.52,9.5 22.82,9.2 22.82,8.07 23.3,7.6 v23.3,6.08 23.38,6.05 24.43,5 v24.55,5.17
BARO_INT1  (via drill 0.33)
  Top 0.152: v29.73,2.83 29.65,2.9 28.93,2.9 BARO.11 | v35.02,3.3 35.02,3.65 v34.38,4.3 | v24.73,3.98 24.73,3.7 U1.37
  Bottom 0.152: v29.73,2.83 29.98,2.83 30.32,2.48 34.2,2.48 v35.02,3.3 | v34.38,4.3 28.95,4.3 28.62,3.98 v24.73,3.98
DRDY_M  (via drill 0.33)
  Top 0.152: v32.95,9.78 32.95,8.93 9-AXIS.9 | v37.1,13.47 36.73,13.47 35,15.2 31.23,15.2 v30.65,14.62 | v26.55,8.07 26.7,8.07 28.55,6.22 U1.46
  Bottom 0.152: v32.95,9.78 32.95,10.15 33.62,10.82 33.62,10.97 34.98,12.32 35.95,12.32 v37.1,13.47 | v30.65,14.62 30.3,14.62 30.05,14.38 26.32,14.38 24.65,12.7 24.65,9.97 v26.55,8.07
GND  (via drill 0.33)
  Top 0.152: v21,1.5 U1.35 | S1.2 5.92,13.35 5.8,13.35 4.72,12.28 C18.2 4.72,11.7 3.33,10.3 3.33,9.18 2.62,8.47 JP2.3 5,6 | C17.2 4.47,4.28 5,4.8 S4.4 | 5,6 S4.4 | v6,4.75 5.05,4.75 S4.4 | 15.88,11.72 C8.2 C11.2 | 15.88,11.72 C14.2 | C9.2 15.88,13.28 | 15.88,13.28 C16.2 15.35,13.28 14.9,13.72 14.9,14.47 15.18,14.75 R8.1 20.48,14.9 21.02,15.45 28.25,15.45 28.77,14.93 R9.1 | 15.88,13.28 v15.88,12.55 15.88,11.72 | R5.2 36.1,11.47 C5.2 36.02,11.53 35.35,11.53 | C19.2 C15.2 33.88,12.53 34.88,11.53 35.35,11.53 | v35.7,9.3 35.88,9.12 C6.1 | v35.35,11 35.35,11.53 | v40.45,8.47 40.1,8.12 39.25,8.12 U$1.7 | v31.18,12.93 30.7,13.4 C1.2 30.45,13.22 U$5.GND1 29.25,13.15 29.25,11.15 U$5.GND2 | 30.14,10.64 29.7,11.07 29.4,11.07 29.35,11.12 U$5.GND2 | 30.14,10.64 30.5,10.28 30.52,10.28 C3.2 30.57,10.2 30.57,9.1 | U$5.GND2 29.27,11.07 28.45,11.07 27.88,10.5 U1.5 27.8,10.45 27.8,10.43 | 30.14,10.64 U1.2 | BARO.16 30.65,1.68 30.85,1.48 31.95,1.48 32.7,2.23 32.8,2.23 C7.2 | C20.2 32.67,2.1 C7.2 | 9-AXIS.17 31.25,7.1 31.23,7.08 31.23,6.58 9-AXIS.18 31.23,6.5 31.23,3.98 BARO.5 | 9-AXIS.17 9-AXIS.16 9-AXIS.15 9-AXIS.14 31.23,8.38 31.07,8.38 30.57,8.88 30.57,9.1 | 9-AXIS.17 31.38,7.1 31.45,7.1 31.65,6.9 9-AXIS.19 31.73,6.58 32.08,6.58 9-AXIS.20 | BARO.13 28.93,1.93 28.93,2.4 BARO.12 28.85,2.4 28.7,2.4 28.4,2.7 28.4,2.95 | 30.12,3.92 29.6,3.4 28.93,3.4 BARO.10 28.85,3.4 28.7,3.4 28.4,3.1 28.4,2.95 | 30.12,3.92 BARO.7 | 30.12,3.92 30.38,3.67 30.88,3.67 31.1,3.9 BARO.5 | 27.4,3.88 28.32,2.95 28.4,2.95 | 27.4,3.88 26.82,4.45 26.8,4.45 U1.41 | 27.52,5.17 27.52,5 27.93,4.6 27.93,4.4 27.4,3.88 | 27.52,5.17 U1.43 | C7.2 32.58,2.2 32.58,2.33 31.88,3.02 31.88,3.6 31.57,3.9 31.43,3.9 BARO.5
  Top 0.152: C29.2 C28.2 C25.2 C24.2 14.05,7.3 14.05,8.45 C30.2 C22.2 C26.2 C27.2 18.05,8.53 v18.52,9 | v30.6,9.1 30.57,9.1 | JP8.2 7.47,6.75 6.75,6.03 5.08,6.03 5,6 | 27.52,5.17 v26.57,6.12
  Bottom 0.152: v21,1.5 19.93,1.5 19.5,1.07 U$4.4 17.5,1.07 16.75,1.82 | C21.2 20.75,4.5 20.45,4.2 18.25,4.2 16.75,2.7 16.75,1.82 | JP6.2 9.55,2.65 9.55,4.12 8.93,4.75 U$6.2 v6,4.75 5.97,4.67 5.45,4.15 5.45,2.55 6.5,1.5 11.95,1.5 12.25,1.8 16.68,1.8 16.75,1.82 | J1.P5 J1.P6 J1.P4 18.73,13.93 18.73,11.78 J1.P1 | J1.P5 J1.P3 13.8,13.93 13.8,11.78 J1.P2 13.8,11.6 12.95,10.75 11.15,10.75 | 11.15,10.75 U$2.2 | JP8.2 11.15,7.85 11.15,10.75 | v15.88,12.55 15.88,13.93 J1.P5 | 36.54,9.81 38.25,11.53 U$3.6 38.9,11.53 39,11.53 39.67,12.2 39.67,12.43 40,12.75 41.02,12.75 | 36.54,9.81 36.02,9.3 v35.7,9.3 35.62,9.28 33.27,9.28 33.1,9.1 v30.6,9.1 | 36.54,9.81 v35.35,11 | 41.02,12.75 41.02,14.5 41,14.53 U$3.G4 | 41.02,12.75 41.02,9.05 v40.45,8.47 40.48,8.4 40.48,7.03 41.9,5.6 41.9,1.38 U$3.G1 | v31.18,12.93 U$3.G3 | J1.GND 18.48,11.35 18.73,11.6 18.73,11.7 J1.P1 | 27.75,7.22 U$3.G2 | J1.P1 18.8,11.57 21.7,11.57 22.73,10.55 22.73,10.18 24.62,8.28 24.62,7.92 25.48,7.08 25.73,6.78 25.9,6.6 26.6,6.6 | v27.45,8.38 27.45,7.3 U$3.G2 | 27.5,7.22 U$3.G2 | 26.6,6.6 27.15,6.6 U$3.G2 | 26.6,5.9 26.6,6.6
  pour Bottom: 0.3,15.62 44.6,15.62 44.6,0.28 0.3,0.28 0.3,15.6
  pour Top: 0.95,15.57 44.75,15.57 44.75,0.28 0.3,0.28 0.3,15.57
I2C0_SCL  (via drill 0.33)
  Top 0.152: v20.88,12.15 R3.2 | v21.8,13.07 21.8,13 U1.15 | v30.57,3.1 30.75,3.1 31.05,3.4 BARO.4 | v34.95,6.75 34.6,7.1 9-AXIS.2
  Bottom 0.152: v20.88,12.15 v21.8,13.07 21.77,13.15 21.77,13.85 20.38,15.25 6.67,15.25 1.4,9.97 1.4,5.08 2.77,3.7 3.85,3.7 7.08,0.47 21,0.47 23.12,2.6 24.6,2.6 25.55,1.65 JP3.1 27.4,3.4 29.98,3.4 30.27,3.1 v30.57,3.1 30.65,3.12 34.02,3.12 34.95,4.05 v34.95,6.75
I2C0_SDA  (via drill 0.33)
  Top 0.152: R2.2 19.6,13.1 20.95,13.1 22.18,11.88 U1.16 22.25,11.85 23.88,10.22 v25.23,10.22 | v30.57,6.85 30.62,6.8 30.62,4.15 BARO.6 | 9-AXIS.4 v32.05,7.95 | JP3.2 23.5,2.75 24.15,3.4 24.15,3.73 23.9,3.98 23.9,4.72 23.7,4.92 23.7,5.42 24.3,6.03 25.25,6.03 25.57,6.35 25.57,7.03 25.5,7.1 25.48,7.1 25.25,7.33 25.23,7.33 24.93,7.62 24.93,8.12 25.9,9.1 v26.82,9.1
  Bottom 0.152: v32.05,7.95 30.95,6.85 v30.57,6.85 30.5,6.88 28.43,8.95 27,8.95 26.35,9.6 | v25.23,10.22 25.73,10.22 26.35,9.6 | 26.35,9.6 v26.82,9.1
I2C1_SCL  (via drill 0.33)
  Top 0.152: R4.2 14.15,4.17 14.7,4.17 15.53,3.35 16.57,3.35 v17,3.77 17.07,3.75 17.95,3.75 18.5,3.2 v21.52,3.2 | v22.73,5.15 22.65,5.15 19.38,8.43 19.38,9.05 U1.24 | v36.8,7.4 37.33,7.92 37.33,8.4 38.55,9.62 U$1.10
  Bottom 0.152: v17,3.77 16.07,3.77 14.65,2.35 U$4.6 | 22.73,4.6 22.73,4.4 v21.52,3.2 | 22.73,4.6 v22.73,5.15 | v36.8,7.4 33.38,7.4 30.75,4.78 28.68,4.78 28.48,4.58 23.68,4.58 23.65,4.6 22.73,4.6
I2C1_SDA  (via drill 0.33)
  Top 0.152: v17.32,2.08 16.57,1.32 15.5,1.32 14.72,2.1 14.15,2.1 R1.2 | U1.22 20.1,9.78 20.1,9.6 21.82,7.88 21.82,6.8 v22.15,6.47 22.07,6.65 v24.9,6.65 | v37.15,9.5 37.77,10.12 U$1.11
  Bottom 0.152: v17.32,2.08 19,2.08 19.27,2.35 19.38,2.35 U$4.3 19.45,2.35 19.85,2.35 22.15,4.65 v22.15,6.47 | v37.15,9.5 36.73,9.5 35.67,8.45 33.38,8.45 30.45,5.53 26.02,5.53 v24.9,6.65
I2CB2B_SCL
  Bottom 0.152: JP6.4 6.5,2.58 6.92,2.58 7.67,1.82 11.82,1.82 13.62,3.62 14.18,3.62 U$4.7
I2CB2B_SDA  (via drill 0.33)
  Top 0.152: v17.9,2.98 17.9,1.6 17.3,1 9.57,1 8,2.58 JP6.3
  Bottom 0.152: v17.9,2.98 18.62,2.98 19.27,3.62 19.38,3.62 U$4.2
INT1_A/G  (via drill 0.33)
  Top 0.152: v32.45,10.93 32.45,10.22 32.08,9.85 32.08,8.93 9-AXIS.11 | U1.45 28.2,5.88 U1.45 27.73,6.38 27.73,6.5 26.85,7.38 26.07,7.38 v25.6,7.85
  Bottom 0.152: v32.45,10.93 32.45,13.65 30.57,15.53 25,15.53 23.23,13.75 23.23,10.25 25.6,7.88 v25.6,7.85
LED_PIN
  Top 0.152: LED2.A 25.25,14.28 26.5,13.03 26.5,12.68 26.1,12.28 U1.10
LED_PIN2
  Top 0.152: LED1.A 24,14.12 24.6,13.53 24.6,12.55 24.95,12.2 25.32,12.2 U1.11
N$1  (via drill 0.33)
  Top 0.152: v31.27,9.68 31.23,9.62 31.23,8.93 9-AXIS.13 | v42.05,6.28 39.2,3.42 36.75,3.42 36.3,2.98 R6.1
  Bottom 0.152: v31.27,9.68 32.02,9.68 33.3,10.95 33.3,11.72 35.88,14.3 36.62,14.3 36.83,14.5 38.92,14.5 39.92,15.5 41.92,15.5 42.15,15.28 42.15,6.38 v42.05,6.28
N$2  (via drill 0.33)
  Top 0.152: U$5.P1 30.25,12.05 31.2,11.1 C3.1 31.25,10.9 v31.77,10.38 | v26.45,10.32 26.45,10.5 27.12,11.18 U1.7
  Bottom 0.152: v26.45,10.32 31.73,10.32 v31.77,10.38
N$3
  Top 0.152: C1.1 30,14.15 29.1,14.15 29.05,14.2 28.82,14.2 28.07,13.45 28.07,12.35 U$5.P2 28.1,12.22 28.1,11.43 27.52,10.85 U1.6
N$4
  Top 0.152: LED1.C R8.2
N$5
  Top 0.152: LED2.C 26.77,14.75 26.8,14.78 R9.2
N$6
  Top 0.152: C4.1 37,5.42 38.25,5.42 38.55,5.12 U$1.1
N$7
  Top 0.152: C4.2 36.02,5.45 36.02,5.58 36.4,5.95 36.65,5.95 36.67,5.97 38.2,5.97 38.55,5.62 U$1.2
N$8
  Top 0.152: C2.1 36.02,6.28 35.58,5.83 35.58,5.03 35.92,4.67 39.98,4.67 40.23,4.92 40.23,5.8 39.9,6.12 39.25,6.12 U$1.3
N$9
  Top 0.152: C2.2 36.98,6.6 39.23,6.6 U$1.4
N$10
  Top 0.152: C5.1 37.05,11.47 38.2,11.47 38.55,11.12 U$1.13
N$11
  Top 0.152: 9-AXIS.21 32.5,3.4 32.73,3.17 32.8,3.17 C7.1
N$12
  Top 0.152: R5.1 37.08,10.5 38.92,10.5 39.05,10.62 U$1.12
N$13  (via drill 0.33)
  Top 0.152: v32.55,14.62 31.9,13.97 31.9,12.28 32.17,12 33.75,12 34.77,10.97 34.77,10.75 35.62,9.9 35.92,9.9 36.83,9 C6.2 | v38.17,15.07 41.02,12.22 41.02,8.22 40.42,7.62 39.25,7.62 U$1.6
  Bottom 0.152: v32.55,14.62 36.5,14.62 36.95,15.07 v38.17,15.07
N$14
  Top 0.152: 9-AXIS.24 33.8,3.38 34.12,3.05 C20.1
N$15  (via drill 0.33)
  Top 0.152: 20.75,10.5 20.77,10.5 U1.20 20.29,10.97 19.85,10.97 18.77,9.9 v18.6,9.93
  Bottom 0.152: J1.D+ 16.25,10.75 16.85,10.15 16.88,10.15 16.88,10.1 18.3,10.1 v18.6,9.93
N$16  (via drill 0.33)
  Top 0.152: R7.1 36.25,1.62 v35.8,2.08
  Bottom 0.152: v35.8,2.08 35.8,2.8 38.58,5.58 38.58,6 38.62,6.05 U$3.1
N$17  (via drill 0.33)
  Top 0.152: v15.9,10.12 17.98,10.12 19.27,11.43 20.55,11.43 U1.19
  Bottom 0.152: J1.D- 15.6,10.47 v15.9,10.12
N$19  (via drill 0.33)
  Top 0.152: v14.62,7.85 17.98,7.85 18.35,7.47 18.35,6.78 18.95,6.17 19.3,6.17 19.7,6.58 U1.26 | v9.75,9.43 9.2,9.97 9.2,11.18 11.38,13.35 12.22,13.35 S1.1
  Bottom 0.152: v14.62,7.85 14.62,7.65 12.62,5.65 11.88,5.65 9.9,7.62 9.9,9.28 v9.75,9.43
N$20
  Top 0.152: S4.1 6.1,10.57 7.92,8.75 JP8.1
N$21  (via drill 0.33)
  Top 0.152: R10.2 35.58,12.62 v35.3,12.9
  Bottom 0.152: v35.3,12.9 35.67,12.9 36.9,14.12 38.12,14.12 38.52,13.72 U$3.8
PIO0_1  (via drill 0.33)
  Top 0.152: U1.4 28.18,10.13 27.68,9.62 27.3,9.62 27.18,9.75 26.05,9.75 24.35,8.05 24.35,7.9 23.9,7.45 22.5,7.45 v22.48,7.42 | S4.5 8.38,4.05 11.12,4.05 11.62,3.55 v12,3.55
  Bottom 0.152: v22.48,7.42 22.18,7.42 21.82,7.78 19.82,7.78 19.3,7.25 19.3,6.25 18.57,5.53 18.23,5.53 17.85,5.15 17.85,4.97 17.35,4.47 16.18,4.47 15.93,4.22 12.68,4.22 v12,3.55
SD_CD  (via drill 0.33)
  Top 0.152: v26.57,13.8 26.57,13.4 26.85,13.12 26.85,12.3 U1.9
  Bottom 0.152: v26.57,13.8 26.57,12.43 27.45,11.55 27.52,11.55 U$3.9
SSP1_MISO  (via drill 0.33)
  Top 0.152: v25.25,11.07 25.8,10.53 25.8,9.97 25.77,9.93 23.7,7.9 23.15,7.9 v22.25,8.8 | v31.82,11.5 33.42,11.5 v34.2,10.72 | U1.29 20.77,5.53 20.38,5.12 17.65,5.12 arc-53 v17.2,5.35
  Bottom 0.152: v25.25,11.07 26.7,11.07 27.02,10.75 31.07,10.75 v31.82,11.5 | v34.2,10.72 34.25,10.72 35.52,12 37.83,12 38.45,12.62 U$3.7 | v22.25,8.8 21.68,8.22 21.65,8.25 19.82,8.25 18.38,6.8 18.38,6.03 arc-62 18.3,5.9 arc-19 17.93,5.78 arc43 v17.2,5.35
SSP1_MOSI  (via drill 0.33)
  Top 0.152: v23.4,8.65 23.35,9.93 21.85,11.43 21.85,11.53 U1.17
  Bottom 0.152: v23.4,8.65 23.4,7.95 23.43,7.95 24.25,7.12 24.25,6.47 25.1,5.62 25.43,5.62 25.9,5.15 30.68,5.15 33.65,8.12 38.42,8.12 38.52,8.22 U$3.3
SSP1_SCK  (via drill 0.33)
  Top 0.152: v23.8,13.5 23.27,12.97 U1.13 | v29.8,14.95 30.15,14.95 30.73,15.53 36.9,15.53 v40.25,12.18
  Bottom 0.152: v23.8,13.5 25,13.5 26.45,14.95 v29.8,14.95 | v40.25,12.18 40.25,11.47 39.2,10.43 38.65,10.43 U$3.5
SSP1_SSEL  (via drill 0.33)
  Top 0.152: 25.77,3.4 25.75,3.4 U1.38 27.55,1.6 v27.55,1.38
  Bottom 0.152: U$3.2 38.08,7.12 37.6,6.65 37.6,5.05 33.92,1.38 v27.55,1.38
USB_VBUS  (via drill 0.33)
  Top 0.152: S4.3 12.4,10.57 v12.8,10.18
  Bottom 0.152: v12.8,10.18 14.38,10.18 14.95,10.75 J1.VBUS
VBUS  (via drill 0.33)
  Top 0.152: JP6.1 10.76,2.59 9.7,3.65 7.7,3.65 v7.55,3.8 7.47,3.77 5.35,3.77 4.72,3.15 3.98,3.15 3.52,3.6 C17.1 3.17,3.75 1.67,5.25 1.67,9.18 JP2.4 2.52,10.07 3.77,11.32 C18.1 3.77,13.47 4.75,14.45 7.12,14.45 7.5,14.07 S4.2
  Bottom 0.152: U$2.1 8.38,11.7 7.75,11.07 7.75,10.43 8.38,9.8 U$2.3 8.35,9.72 8.35,8.35 8.1,8.1 8.1,6.3 8.62,5.78 U$6.1 8.93,5.7 10.97,3.65 10.97,2.6 JP6.1 | U$6.3 v7.55,3.8